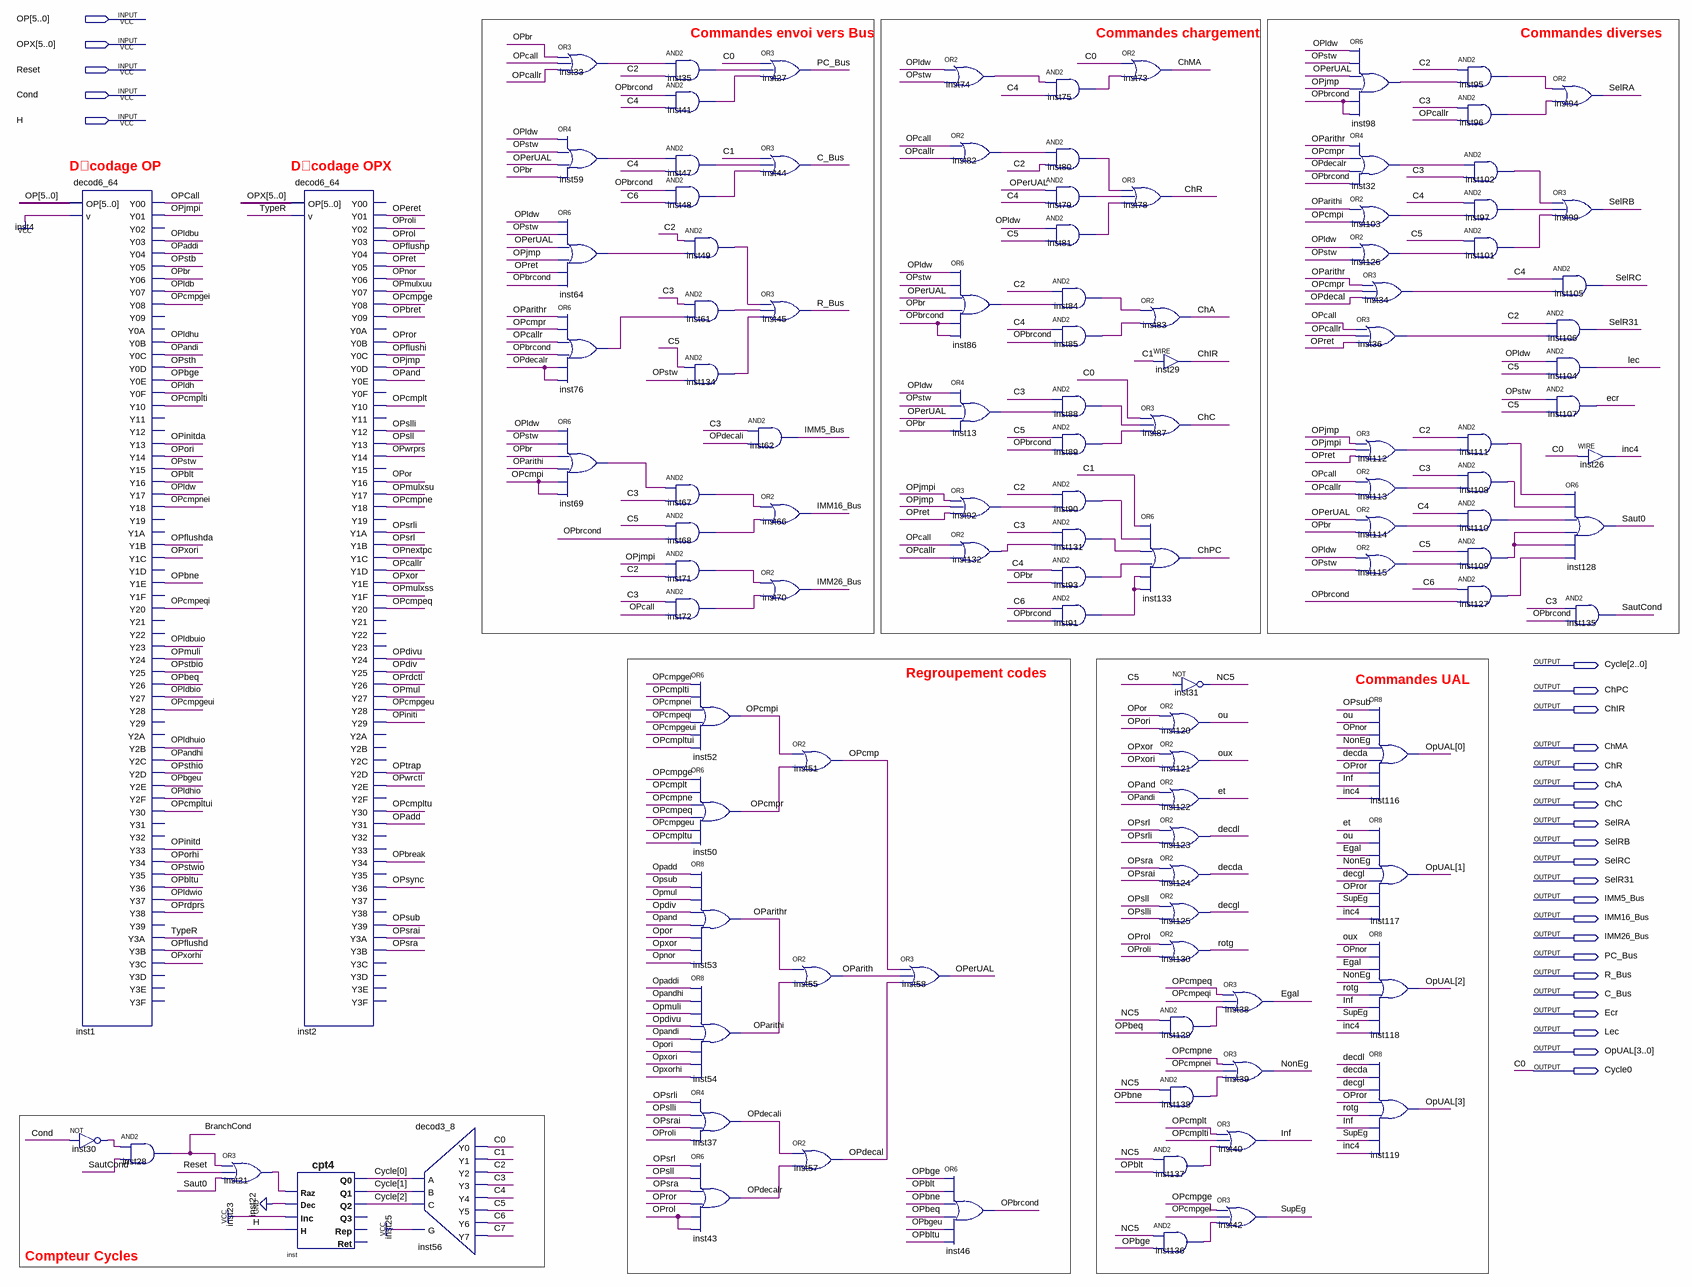
[diagram p0: schematic sheet]
// Quartus schematic UC.bdf as structural Verilog: 113 symbols, 26 pins
module UC (
  input  [5:0] OP,
  input  [5:0] OPX,
  input  Reset,
  input  Cond,
  input  H,
  output [2:0] Cycle,
  output ChPC,
  output ChIR,
  output ChMA,
  output ChR,
  output ChA,
  output ChC,
  output SelRA,
  output SelRB,
  output SelRC,
  output SelR31,
  output IMM5_Bus,
  output IMM16_Bus,
  output IMM26_Bus,
  output PC_Bus,
  output R_Bus,
  output C_Bus,
  output Ecr,
  output Lec,
  output [3:0] OpUAL,
  output Cycle0
);

  wire BranchCond, C1, C2, C3, C4, C5, C6, C7, decda, decdl, decgl, Egal, et, inc4, Inf, inst13_out,
       inst21_out, inst30_out, inst32_out, inst33_out, inst34_out, inst35_out, inst36_out, inst41_out,
       inst47_out, inst48_out, inst49_out, inst59_out, inst61_out, inst64_out, inst67_out, inst68_out,
       inst69_out, inst71_out, inst72_out, inst74_out, inst75_out, inst76_out, inst79_out, inst80_out,
       inst81_out, inst82_out, inst84_out, inst85_out, inst86_out, inst88_out, inst89_out, inst90_out,
       inst91_out, inst92_out, inst93_out, inst95_out, inst96_out, inst97_out, inst98_out, inst101_out,
       inst102_out, inst103_out, inst108_out, inst109_out, inst110_out, inst111_out, inst112_out,
       inst113_out, inst114_out, inst115_out, inst126_out, inst127_out, inst129_out, inst131_out,
       inst132_out, inst134_out, inst136_out, inst137_out, inst138_out, NC5, NonEg, OPadd, OPaddi, OPand,
       OPandhi, OPandi, OParith, OParithi, OParithr, OPbeq, OPbge, OPbgeu, OPblt, OPbltu, OPbne, OPbr,
       OPbrcond, OPbreak, OPbret, OPcall, OPcallr, OPcmp, OPcmpeq, OPcmpeqi, OPcmpge, OPcmpgei, OPcmpgeu,
       OPcmpgeui, OPcmpi, OPcmplt, OPcmplti, OPcmpltu, OPcmpltui, OPcmpne, OPcmpnei, OPcmpr, OPdecal,
       OPdecali, OPdecalr, OPdiv, OPdivu, OPeret, OPerUAL, OPflushd, OPflushda, OPflushi, OPflushp, OPinitd,
       OPinitda, OPiniti, OPjmp, OPjmpi, OPldb, OPldbio, OPldbu, OPldbuio, OPldh, OPldhio, OPldhu, OPldhuio,
       OPldw, OPldwio, OPmul, OPmuli, OPmulxss, OPmulxsu, OPmulxuu, OPnextpc, OPnor, OPor, OPorhi, OPori,
       OPrdctl, OPrdprs, OPret, OProl, OProli, OPror, OPsll, OPslli, OPsra, OPsrai, OPsrl, OPsrli, OPstb,
       OPstbio, OPsth, OPsthio, OPstw, OPstwio, OPsub, OPsync, OPtrap, OPwrctl, OPwrprs, OPxor, OPxorhi,
       OPxori, ou, oux, rotg, Saut0, SautCond, SupEg, TypeR;

  decod6_64 inst1 (
    .OP(OP), .v(1'b1), .Y00(OPcall), .Y01(OPjmpi), .Y03(OPldbu), .Y04(OPaddi), .Y05(OPstb), .Y06(OPbr),
    .Y07(OPldb), .Y08(OPcmpgei), .Y0B(OPldhu), .Y0C(OPandi), .Y0D(OPsth), .Y0E(OPbge), .Y0F(OPldh),
    .Y10(OPcmplti), .Y13(OPinitda), .Y14(OPori), .Y15(OPstw), .Y16(OPblt), .Y17(OPldw), .Y18(OPcmpnei),
    .Y1B(OPflushda), .Y1C(OPxori), .Y1E(OPbne), .Y20(OPcmpeqi), .Y23(OPldbuio), .Y24(OPmuli), .Y25(OPstbio),
    .Y26(OPbeq), .Y27(OPldbio), .Y28(OPcmpgeui), .Y2B(OPldhuio), .Y2C(OPandhi), .Y2D(OPsthio), .Y2E(OPbgeu),
    .Y2F(OPldhio), .Y30(OPcmpltui), .Y33(OPinitd), .Y34(OPorhi), .Y35(OPstwio), .Y36(OPbltu), .Y37(OPldwio),
    .Y38(OPrdprs), .Y3A(TypeR), .Y3B(OPflushd), .Y3C(OPxorhi));  // open: Y02, Y09, Y0A, Y11, Y12, Y19, Y1A, Y1D, Y1F, Y21, Y22, Y29, Y2A, Y31, Y32, Y39, Y3D, Y3E, Y3F
  not inst30 (inst30_out, Cond);
  and inst28 (BranchCond, inst30_out, SautCond);
  or inst21 (inst21_out, BranchCond, Reset, Saut0);
  decod6_64 inst2 (
    .OP(OPX), .v(TypeR), .Y01(OPeret), .Y02(OProli), .Y03(OProl), .Y04(OPflushp), .Y05(OPret), .Y06(OPnor),
    .Y07(OPmulxuu), .Y08(OPcmpge), .Y09(OPbret), .Y0B(OPror), .Y0C(OPflushi), .Y0D(OPjmp), .Y0E(OPand),
    .Y10(OPcmplt), .Y12(OPslli), .Y13(OPsll), .Y14(OPwrprs), .Y16(OPor), .Y17(OPmulxsu), .Y18(OPcmpne),
    .Y1A(OPsrli), .Y1B(OPsrl), .Y1C(OPnextpc), .Y1D(OPcallr), .Y1E(OPxor), .Y1F(OPmulxss), .Y20(OPcmpeq),
    .Y24(OPdivu), .Y25(OPdiv), .Y26(OPrdctl), .Y27(OPmul), .Y28(OPcmpgeu), .Y29(OPiniti), .Y2D(OPtrap),
    .Y2E(OPwrctl), .Y30(OPcmpltu), .Y31(OPadd), .Y34(OPbreak), .Y36(OPsync), .Y39(OPsub), .Y3A(OPsrai),
    .Y3B(OPsra));  // open: Y00, Y0A, Y0F, Y11, Y15, Y19, Y21, Y22, Y23, Y2A, Y2B, Y2C, Y2F, Y32, Y33, Y35, Y37, Y38, Y3C, Y3D, Y3E, Y3F
  cpt4 inst (
    .Raz(inst21_out), .Dec(1'b0), .Inc(1'b1), .H(H), .Q0(Cycle[0]), .Q1(Cycle[1]), .Q2(Cycle[2]));  // open: Q3, Rep, Ret
  decod3_8 inst56 (
    .G(1'b1), .A(Cycle[0]), .B(Cycle[1]), .C(Cycle[2]), .Y0(Cycle[0]), .Y1(C1), .Y2(C2), .Y3(C3), .Y4(C4),
    .Y5(C5), .Y6(C6), .Y7(C7));
  or inst33 (inst33_out, OPbr, OPcall, OPcallr);
  or inst59 (inst59_out, OPldw, OPstw, OPerUAL, OPbr);
  or inst64 (inst64_out, OPldw, OPstw, OPerUAL, OPjmp, OPret, OPbrcond);
  or inst76 (inst76_out, OParithr, OPcmpr, OPcallr, OPbrcond, OPdecalr, OPdecalr);
  or inst69 (inst69_out, OPldw, OPstw, OPbr, OParithi, OPcmpi, OPcmpi);
  and inst35 (inst35_out, inst33_out, C2);
  and inst41 (inst41_out, OPbrcond, C4);
  and inst47 (inst47_out, inst59_out, C4);
  and inst48 (inst48_out, OPbrcond, C6);
  and inst49 (inst49_out, C2, inst64_out);
  and inst61 (inst61_out, C3, inst76_out);
  and inst134 (inst134_out, C5, OPstw);
  and inst67 (inst67_out, inst69_out, C3);
  and inst68 (inst68_out, C5, OPbrcond);
  and inst71 (inst71_out, OPjmpi, C2);
  and inst72 (inst72_out, C3, OPcall);
  or inst52 (OPcmpi, OPcmpgei, OPcmplti, OPcmpnei, OPcmpeqi, OPcmpgeui, OPcmpltui);
  or inst50 (OPcmpr, OPcmpge, OPcmplt, OPcmpne, OPcmpeq, OPcmpgeu, OPcmpltu);
  or inst53 (OParithr, OPadd, OPsub, OPmul, OPdiv, OPand, OPor, OPxor, OPnor);
  or inst54 (OParithi, OPaddi, OPandhi, OPmuli, OPdivu, OPandi, OPori, OPxori, OPxorhi);
  or inst37 (OPdecali, OPsrli, OPslli, OPsrai, OProli);
  or inst43 (OPdecalr, OPsrl, OPsll, OPsra, OPror, OProl, OProl);
  or inst27 (PC_Bus, Cycle[0], inst35_out, inst41_out);
  or inst44 (C_Bus, C1, inst47_out, inst48_out);
  or inst45 (R_Bus, inst49_out, inst61_out, inst134_out);
  and inst62 (IMM5_Bus, C3, OPdecali);
  or inst66 (IMM16_Bus, inst67_out, inst68_out);
  or inst70 (IMM26_Bus, inst71_out, inst72_out);
  or inst51 (OPcmp, OPcmpi, OPcmpr);
  or inst55 (OParith, OParithr, OParithi);
  or inst57 (OPdecal, OPdecali, OPdecalr);
  or inst58 (OPerUAL, OPcmp, OParith, OPdecal);
  or inst74 (inst74_out, OPldw, OPstw);
  or inst82 (inst82_out, OPcall, OPcallr);
  or inst86 (inst86_out, OPldw, OPstw, OPerUAL, OPbr, OPbrcond, OPbrcond);
  or inst13 (inst13_out, OPldw, OPstw, OPerUAL, OPbr);
  or inst92 (inst92_out, OPjmpi, OPjmp, OPret);
  or inst132 (inst132_out, OPcall, OPcallr);
  or inst46 (OPbrcond, OPbge, OPblt, OPbne, OPbeq, OPbgeu, OPbltu);
  and inst75 (inst75_out, inst74_out, C4);
  and inst80 (inst80_out, inst82_out, C2);
  and inst79 (inst79_out, OPerUAL, C4);
  and inst81 (inst81_out, OPldw, C5);
  and inst84 (inst84_out, C2, inst86_out);
  and inst85 (inst85_out, C4, OPbrcond);
  and inst88 (inst88_out, C3, inst13_out);
  and inst89 (inst89_out, C5, OPbrcond);
  and inst90 (inst90_out, C2, inst92_out);
  and inst131 (inst131_out, C3, inst132_out);
  and inst93 (inst93_out, C4, OPbr);
  and inst91 (inst91_out, C6, OPbrcond);
  or inst73 (ChMA, Cycle[0], inst75_out);
  or inst78 (ChR, inst80_out, inst79_out, inst81_out);
  or inst83 (ChA, inst84_out, inst85_out);
  assign ChIR = C1;  // WIRE inst29
  or inst87 (ChC, Cycle[0], inst88_out, inst89_out);
  or inst133 (ChPC, C1, inst90_out, inst131_out, inst93_out, inst91_out, inst91_out);
  or inst120 (ou, OPor, OPori);
  or inst121 (oux, OPxor, OPxori);
  or inst122 (et, OPand, OPandi);
  or inst123 (decdl, OPsrl, OPsrli);
  or inst124 (decda, OPsra, OPsrai);
  or inst125 (decgl, OPsll, OPslli);
  or inst130 (rotg, OProl, OProli);
  and inst129 (inst129_out, NC5, OPbeq);
  and inst138 (inst138_out, NC5, OPbne);
  and inst137 (inst137_out, NC5, OPblt);
  and inst136 (inst136_out, NC5, OPbge);
  not inst31 (NC5, C5);
  or inst40 (Inf, OPcmplt, OPcmplti, inst137_out);
  or inst42 (SupEg, OPcmpge, OPcmpgei, inst136_out);
  or inst38 (Egal, OPcmpeq, OPcmpeqi, inst129_out);
  or inst39 (NonEg, OPcmpne, OPcmpnei, inst138_out);
  or inst98 (inst98_out, OPldw, OPstw, OPerUAL, OPjmp, OPbrcond, OPbrcond);
  or inst32 (inst32_out, OParithr, OPcmpr, OPdecalr, OPbrcond);
  or inst103 (inst103_out, OParithi, OPcmpi);
  or inst126 (inst126_out, OPldw, OPstw);
  or inst34 (inst34_out, OParithr, OPcmpr, OPdecal);
  or inst36 (inst36_out, OPcall, OPcallr, OPret);
  or inst112 (inst112_out, OPjmp, OPjmpi, OPret);
  or inst113 (inst113_out, OPcall, OPcallr);
  or inst114 (inst114_out, OPerUAL, OPbr);
  or inst115 (inst115_out, OPldw, OPstw);
  or inst116 (OpUAL[0], OPsub, ou, OPnor, NonEg, decda, OPror, Inf, inc4);
  or inst117 (OpUAL[1], et, ou, Egal, NonEg, decgl, OPror, SupEg, inc4);
  or inst118 (OpUAL[2], oux, OPnor, Egal, NonEg, rotg, Inf, SupEg, inc4);
  or inst119 (OpUAL[3], decdl, decda, decgl, OPror, rotg, Inf, SupEg, inc4);
  and inst95 (inst95_out, C2, inst98_out);
  and inst96 (inst96_out, C3, OPcallr);
  and inst102 (inst102_out, inst32_out, C3);
  and inst97 (inst97_out, C4, inst103_out);
  and inst101 (inst101_out, C5, inst126_out);
  and inst111 (inst111_out, C2, inst112_out);
  and inst108 (inst108_out, C3, inst113_out);
  and inst110 (inst110_out, C4, inst114_out);
  and inst109 (inst109_out, C5, inst115_out);
  and inst127 (inst127_out, C6, OPbrcond);
  or inst94 (SelRA, inst95_out, inst96_out);
  or inst99 (SelRB, inst102_out, inst97_out, inst101_out);
  and inst105 (SelRC, C4, inst34_out);
  and inst106 (SelR31, C2, inst36_out);
  and inst104 (Lec, OPldw, C5);
  and inst107 (Ecr, OPstw, C5);
  or inst128 (Saut0, inst111_out, inst108_out, inst110_out, inst109_out, inst109_out, inst127_out);
  and inst135 (SautCond, C3, OPbrcond);
  assign inc4 = Cycle[0];  // WIRE inst26

  assign Cycle0 = Cycle[0];

  // Other names for the same wires on the sheet: C0 = Cycle[0]

  // Notes on the sheet:
  //   Commandes envoi vers Bus
  //   Commandes chargement
  //   Commandes diverses
  //   D�codage OP
  //   D�codage OPX
  //   Regroupement codes
  //   Commandes UAL
  //   Compteur Cycles
endmodule
